# Altium schematic sheet ext_supply_con.SchDoc
size A3; DocumentNumber: 19; SheetNumber: 19; SheetTotal: 19; SheetDescription: External Power Supply Connector
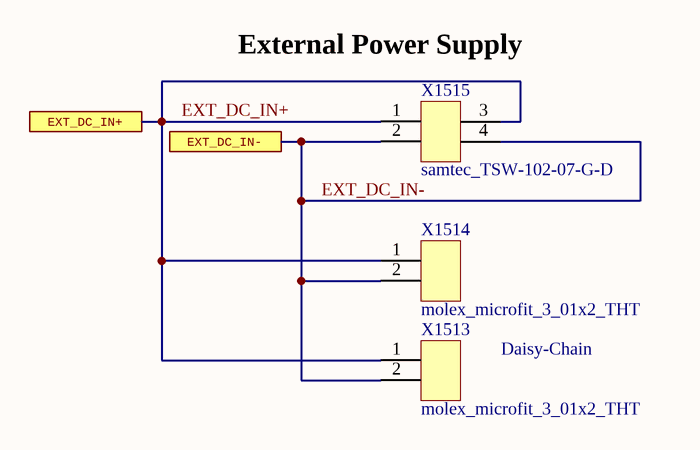
[diagram p0: ext_supply_con.SchDoc]

## Parts
X1513  molex_microfit_3_01x2_THT  [MOLEX_MICROFIT_01x2_THT]
X1514  molex_microfit_3_01x2_THT  [MOLEX_MICROFIT_01x2_THT]
X1515  samtec_TSW-102-07-G-D  [Pinheader_2.54_2x2]

## Ports
EXT_DC_IN+, EXT_DC_IN-

## Nets
EXT_DC_IN+: X1513.1 X1514.1 X1515.1 X1515.3 ; port EXT_DC_IN+
EXT_DC_IN-: X1513.2 X1514.2 X1515.2 X1515.4 ; port EXT_DC_IN-

## Notes on the sheet
- (near X1515) External Power Supply
- Daisy-Chain
- Fraunhofer IISB
- Schottkystr. 10
- developed by:
- 91058 Erlangen
- Germany
- Author
- Project
- License
- Description
- File
- Version
- Release Date
- Sheet
- www.foxbms.org
- www.iisb.fraunhofer.de
- foxBMS Team
- /

## Library data of the parts
X1513 X1514 = molex_microfit_3_01x2_THT: Micro-Fit 3.0 Right Angle Header, 3.00mm Pitch, Dual Row, 2 Circuits, with Snap-in Plastic Peg PCB Lock, Tin, Glow Wire Capable, Black, 43045-0200; Manufacturer: Molex; Circuits: 2; Rated Voltage: 600V; Rated Current: 8.5A; Automotive Qualified: False; Part Number: molex_microfit_3_01x2_THT; Part Name: MicroFit; Operating Temperature: -40°C - +105°C; Supplier 1: Farnell; Supplier Part Number 1: 1012251
X1515 = samtec_TSW-102-07-G-D: Board-To-Board Connector, Vertical, 2.54 mm, 4 Contacts, Header, TSW Series, Through Hole, 2 Rows; Manufacturer: Samtec; Circuits: 4; Rated Voltage: 500V AC mated with SSW; Automotive Qualified: False; Part Number: samtec_TSW-102-07-G-D; Part Name: TSW-102-07-G-D; Operating Temperature: -55°C - +125°C; ComponentLink1Description: Datasheet; ComponentLink1URL: http://www.farnell.com/datasheets/1992055.pdf; Supplier 1: Farnell; Supplier Part Number 1: 2025248